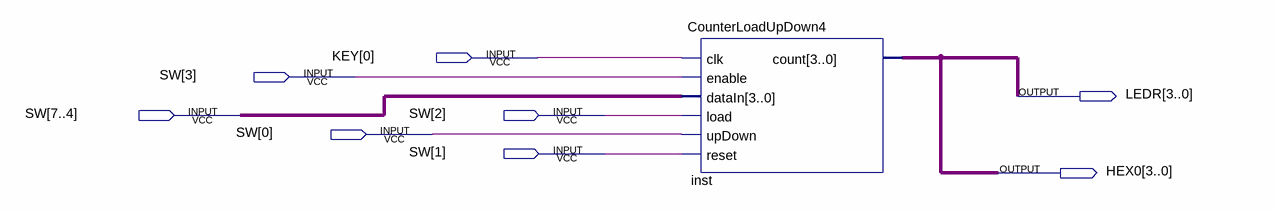
[diagram p0: schematic sheet]
// Quartus schematic Counter_Demo.bdf as structural Verilog: 1 symbols, 8 pins
module Counter_Demo (
  input  [0:0] KEY,
  input  [7:0] SW,
  output [3:0] LEDR,
  output [3:0] HEX0
);

  CounterLoadUpDown4 inst (
    .clk(KEY[0]), .enable(SW[3]), .dataIn(SW[7:4]), .load(SW[2]), .upDown(SW[0]), .reset(SW[1]), .count(HEX0));

  assign LEDR = HEX0;
endmodule
